# Altium project ESP32.PrjPcb
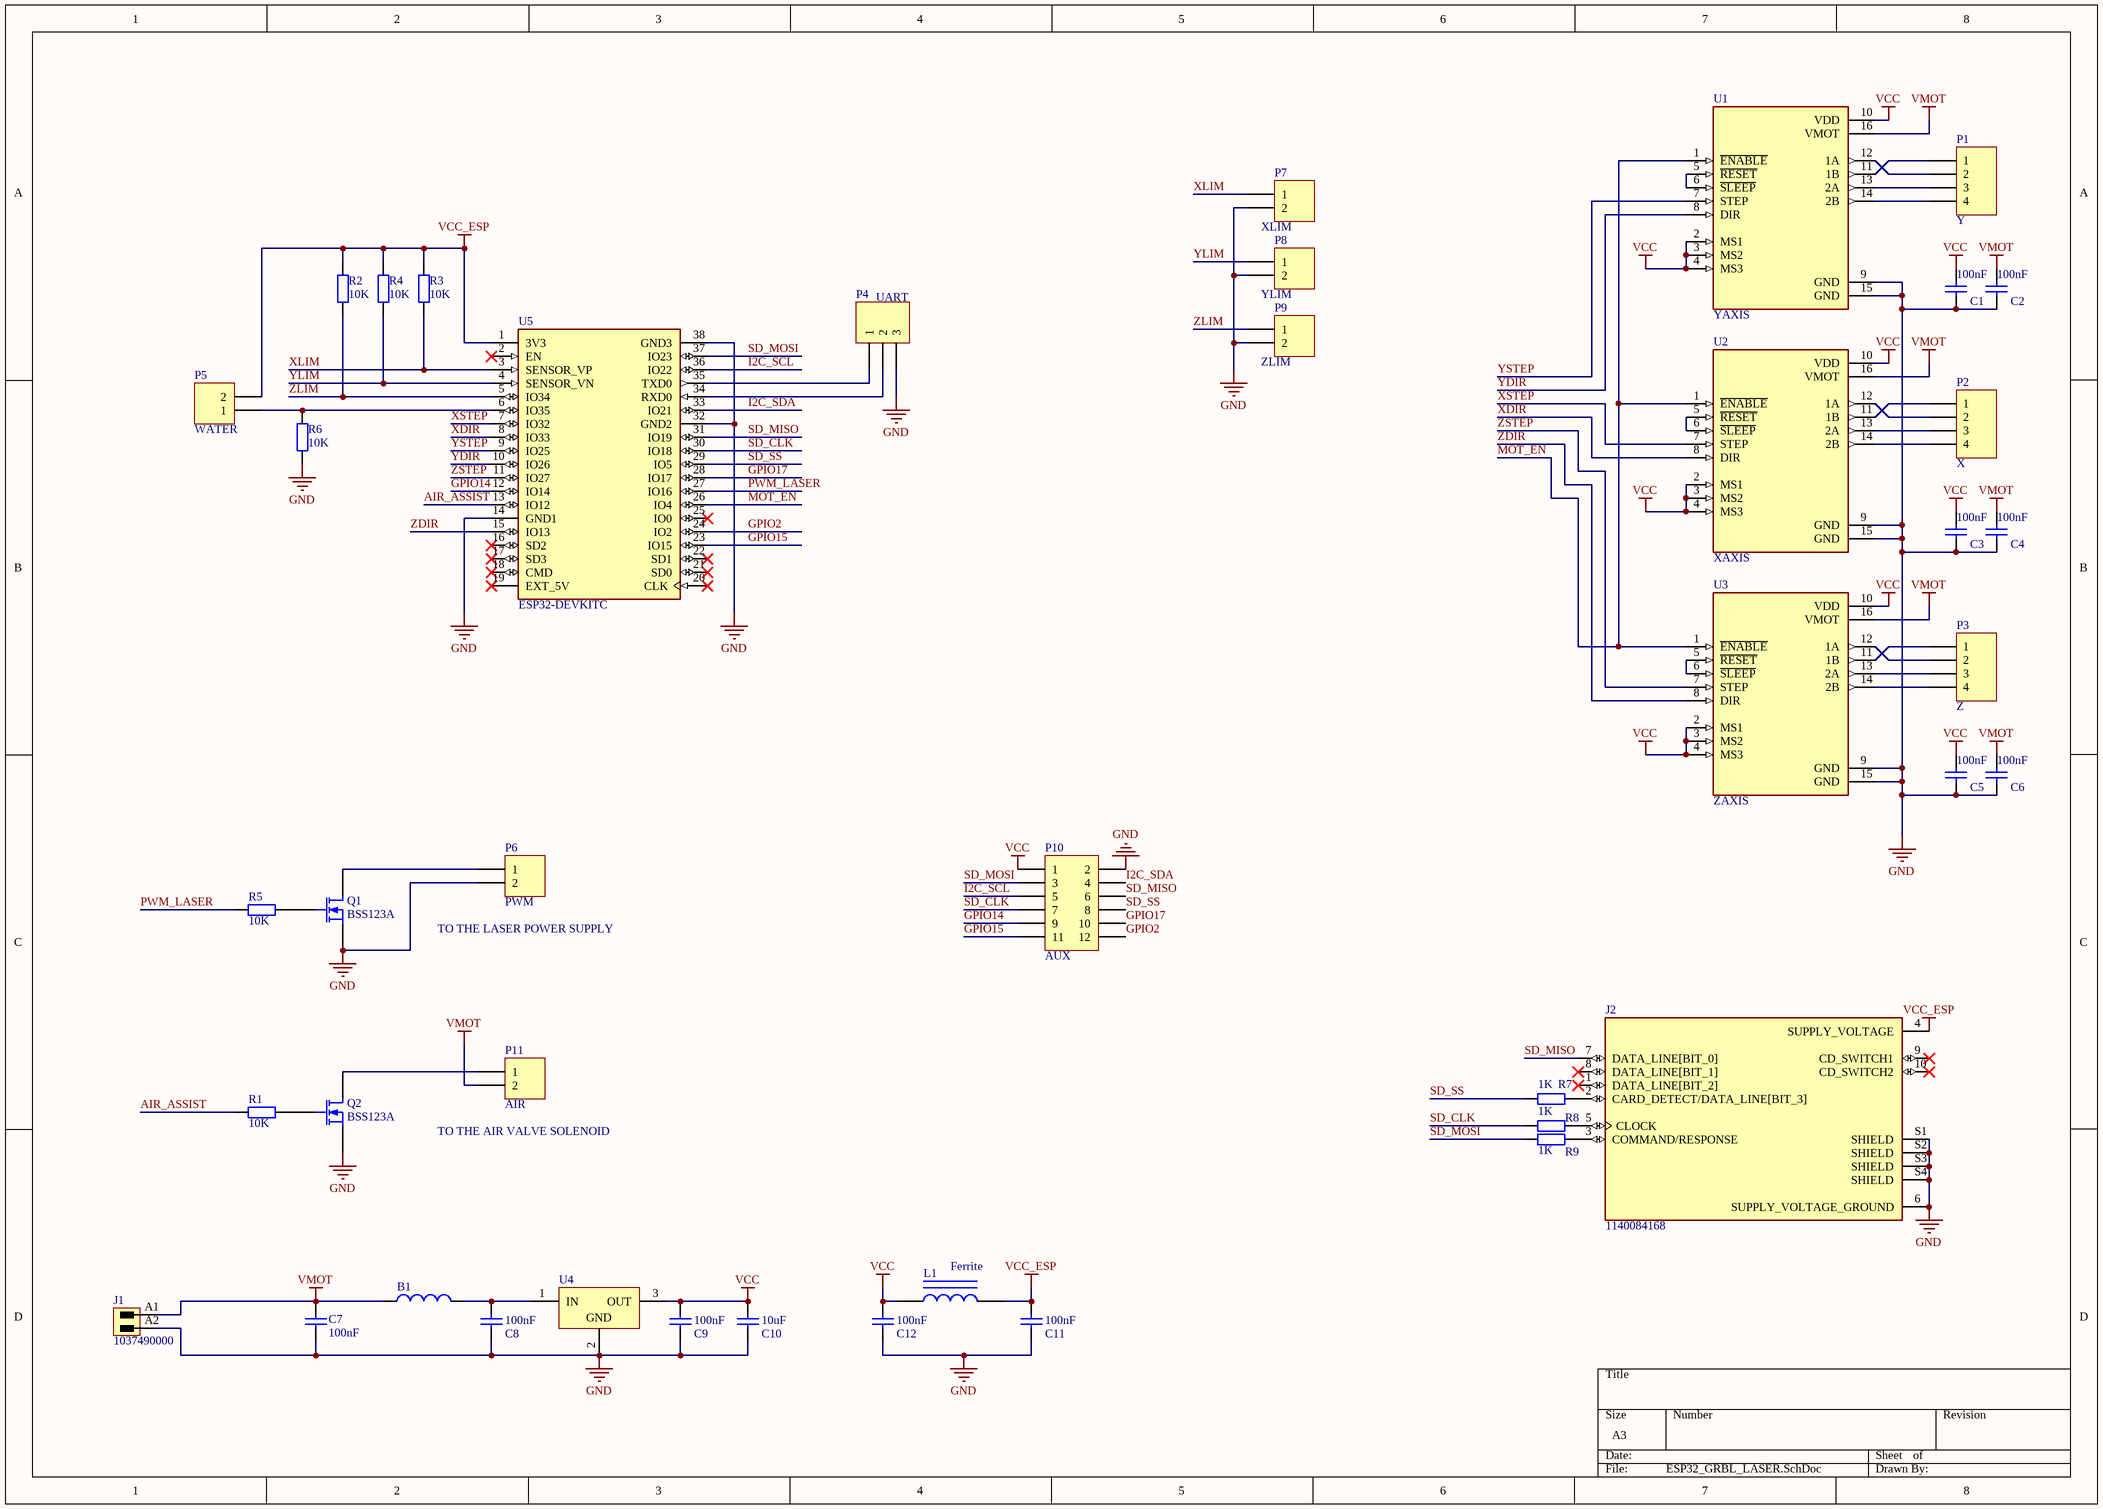
[diagram p0: ESP32_GRBL_LASER.SchDoc]
1 sheet, 43 parts. Net scope: global (net labels, ports and power ports of the same name join across sheets).
Board file: ESP32_GRBL_LASER.PcbDoc

## Sheet ESP32_GRBL_LASER.SchDoc
size A3

### Parts
B1  Ferrite  [INDC3225N]  (value not drawn)
C1  value 100nF  [0805]  (hidden comment: Cap Semi)
C2  value 100nF  [0805]  (hidden comment: Cap Semi)
C3  value 100nF  [0805]  (hidden comment: Cap Semi)
C4  value 100nF  [0805]  (hidden comment: Cap Semi)
C5  value 100nF  [0805]  (hidden comment: Cap Semi)
C6  value 100nF  [0805]  (hidden comment: Cap Semi)
C7  value 100nF  [0805]  (hidden comment: Cap Semi)
C8  value 100nF  [0805]  (hidden comment: Cap Semi)
C9  value 100nF  [0805]  (hidden comment: Cap Semi)
C10  value 10uF  [1210]  (hidden comment: Cap Semi)
C11  value 100nF  [0805]  (hidden comment: Cap Semi)
C12  value 100nF  [0805]  (hidden comment: Cap Semi)
J1  1037490000  [SC_3_81_270G_02]
J2  1140084168  [AMPHENOL_1140084168]
L1  Ferrite  [INDC2012N]
P1  Y  [HDR1X4]
P2  X  [HDR1X4]
P3  Z  [HDR1X4]
P4  UART  [HDR1X3]
P5  WATER  [HDR1X2]
P6  PWM  [HDR1X2]
P7  XLIM  [HDR1X2]
P8  YLIM  [HDR1X2]
P9  ZLIM  [HDR1X2]
P10  AUX  [HDR2X6]
P11  AIR  [HDR1X2]
Q1  BSS123A  [SOT23_M]
Q2  BSS123A  [SOT23_M]
R1  value 10K  [0805]  (hidden comment: Res2)
R2  value 10K  [0805]  (hidden comment: Res2)
R3  value 10K  [0805]  (hidden comment: Res2)
R4  value 10K  [0805]  (hidden comment: Res2)
R5  value 10K  [0805]  (hidden comment: Res2)
R6  value 10K  [0805]  (hidden comment: Res2)
R7  value 1K  [0805]  (hidden comment: Res2)
R8  value 1K  [0805]  (hidden comment: Res2)
R9  value 1K  [0805]  (hidden comment: Res2)
U1  YAXIS  [MODULE_A4988_STEPPER_MOTOR_DRIVER_CARRIER]
U2  XAXIS  [MODULE_A4988_STEPPER_MOTOR_DRIVER_CARRIER]
U3  ZAXIS  [MODULE_A4988_STEPPER_MOTOR_DRIVER_CARRIER]
U4  3V3REG  [TRS1-24xx]  (value not drawn)
U5  ESP32-DEVKITC  [MODULE_ESP32-DEVKITC]

### Nets
GND: C1.2 C2.2 C3.2 C4.2 C5.2 C6.2 C7.1 C8.2 C9.2 C10.2 C11.2 C12.2 J1.A2 J2.6(SUPPLY_VOLTAGE_GROUND) J2.S1(SHIELD) J2.S2(SHIELD) J2.S3(SHIELD) J2.S4(SHIELD) P4.3 P6.2 P7.2 P8.2 P9.2 P10.2 Q1.2(S) Q2.2(S) R6.1 U1.9(GND) U1.15(GND) U2.9(GND) U2.15(GND) U3.9(GND) U3.15(GND) U4.2(GND) U5.14(GND1) U5.32(GND2) U5.38(GND3)
VCC: C1.1 C3.1 C5.1 C9.1 C10.1 C12.1 L1.1 P10.1 U1.2(MS1) U1.3(MS2) U1.4(MS3) U1.10(VDD) U2.2(MS1) U2.3(MS2) U2.4(MS3) U2.10(VDD) U3.2(MS1) U3.3(MS2) U3.4(MS3) U3.10(VDD) U4.3(OUT)
VCC_ESP: C11.1 J2.4(SUPPLY_VOLTAGE) L1.2 P5.2 R2.1 R3.1 R4.1 U5.1(3V3)
VMOT: B1.1 C2.1 C4.1 C6.1 C7.2 J1.A1 P11.2 U1.16(VMOT) U2.16(VMOT) U3.16(VMOT)
AIR_ASSIST: R1.1 U5.13(IO12)
GPIO2: P10.12 U5.24(IO2)
GPIO14: P10.9 U5.12(IO14)
GPIO15: P10.11 U5.23(IO15)
GPIO17: P10.10 U5.28(IO17)
I2C_SCL: P10.5 U5.36(IO22)
I2C_SDA: P10.4 U5.33(IO21)
MOT_EN: U1.1(~{ENABLE}) U2.1(~{ENABLE}) U3.1(~{ENABLE}) U5.26(IO4)
PWM_LASER: R5.1 U5.27(IO16)
SD_CLK: P10.7 R8.1 U5.30(IO18)
SD_MISO: J2.7(DATA_LINE[BIT_0]) P10.6 U5.31(IO19)
SD_MOSI: P10.3 R9.1 U5.37(IO23)
SD_SS: P10.8 R7.1 U5.29(IO5)
XDIR: U2.8(DIR) U5.8(IO33)
XLIM: P7.1 R3.2 U5.3(SENSOR_VP)
XSTEP: U2.7(STEP) U5.7(IO32)
YDIR: U1.8(DIR) U5.10(IO26)
YLIM: P8.1 R4.2 U5.4(SENSOR_VN)
YSTEP: U1.7(STEP) U5.9(IO25)
ZDIR: U3.8(DIR) U5.15(IO13)
ZLIM: P9.1 R2.2 U5.5(IO34)
ZSTEP: U3.7(STEP) U5.11(IO27)
NetB1_2: B1.2 C8.1 U4.1(IN)
NetJ2_2: J2.2(CARD_DETECT/DATA_LINE[BIT_3]) R7.2
NetJ2_3: J2.3(COMMAND/RESPONSE) R9.2
NetJ2_5: J2.5(CLOCK) R8.2
NetP1_1: P1.1 U1.11(1B)
NetP1_2: P1.2 U1.12(1A)
NetP1_3: P1.3 U1.13(2A)
NetP1_4: P1.4 U1.14(2B)
NetP2_1: P2.1 U2.11(1B)
NetP2_2: P2.2 U2.12(1A)
NetP2_3: P2.3 U2.13(2A)
NetP2_4: P2.4 U2.14(2B)
NetP3_1: P3.1 U3.11(1B)
NetP3_2: P3.2 U3.12(1A)
NetP3_3: P3.3 U3.13(2A)
NetP3_4: P3.4 U3.14(2B)
NetP4_1: P4.1 U5.35(TXD0)
NetP4_2: P4.2 U5.34(RXD0)
NetP5_1: P5.1 R6.2 U5.6(IO35)
NetP6_1: P6.1 Q1.1(D)
NetP11_1: P11.1 Q2.1(D)
NetQ1_3: Q1.3(G) R5.2
NetQ2_3: Q2.3(G) R1.2
NetU1_5: U1.5(~{RESET}) U1.6(~{SLEEP})
NetU2_5: U2.5(~{RESET}) U2.6(~{SLEEP})
NetU3_5: U3.5(~{RESET}) U3.6(~{SLEEP})

Not connected (* = marked no-connect by the designer): J2 1(DATA_LINE[BIT_2])* 8(DATA_LINE[BIT_1])* 9(CD_SWITCH1)* 10(CD_SWITCH2)*; U5 2(EN)* 16(SD2)* 17(SD3)* 18(CMD)* 19(EXT_5V)* 20(CLK)* 21(SD0)* 22(SD1)* 25(IO0)*

### Notes on the sheet
- (near P6) TO THE LASER POWER SUPPLY
- (near P11) TO THE AIR VALVE SOLENOID

### Library data of the parts
B1 = Inductor: Manufacturer: Murata; Manufacturer ref: BLM31P121; Conti: 1; Revision: July-2002: Re-released for DXP Platform.; Supplier: Farnell; Supplier 2: Continental; Supplier ref: 5807293; Supplier ref 2: A2C00008628
C1-C6 C8 C9 C11 C12 = Cap Semi: Capacitor (Semiconductor SIM Model); Manufacturer: Generic Components; Voltage: 50V; Conti: 67; Revision: July-2002: Re-released for DXP Platform.; Supplier: Continental; Supplier ref: A2C00046692
C7 = Cap Semi: Capacitor (Semiconductor SIM Model); Manufacturer: Generic Components; Voltage: 50V; Conti: 30; Revision: July-2002: Re-released for DXP Platform.; Supplier: Continental; Supplier ref: A2C00046692
C10 = Cap Semi: Capacitor (Semiconductor SIM Model); Manufacturer: Generic Components; Voltage: 25V; Conti: 47; Revision: July-2002: Re-released for DXP Platform.; Supplier: Continental; Supplier ref: A2C00038896
J1 = 1037490000: OMNIMATE Signal - series BC/SC 3.81; Manufacturer: Weidmueller; Short_text_for_material: SC 3.81/02/270G 3.2SN OR BX; Side_termination_characteristic: closed side; Mounting_onto_the_PCB: Solder connection; Pitch_mm: 3.81 mm; Pitch_inch: 0.15 inch; No_of_poles: 2; Outgoing_elbow: 270°; Solder_pin_length_mm: 3.2 mm; Contact_material: Cu-Leg; Contact_surface: tinned; Insulating_material: PA GF; UL_94_flammability_rating: V-0; Rated_voltage_for_surge_voltage_class_pollution_degree_II_2: 320 V; Rated_voltage_use_group_B_UL_1059: 300 V; Rated_current_use_group_B_UL_1059: 10 A; PackageReference: SC_3_81_270G_02; Colour: Orange; Packaging: Box; Qty: 50 PCS; Revision: V1; PartNumber: 1037490000; ComponentLink1Description: Manufacturer URL; ComponentLink1URL: http://www.weidmueller.com/; ComponentLink2Description: URL Link1; ComponentLink2URL: http://catalog.weidmueller.com/catalog/Start.do?localeId=en&ObjectID=1037490000
J2 = 1140084168: 10 _8 + 2_ Position Card Connector Secure Digital - microSDâ„¢ Surface Mount, Right Angle Gold; MF: Amphenol Commercial Products; SnapEDA_Link: https://www.snapeda.com/parts/1140084168/Amphenol/view-part/4544529/?ref=snap; MP: 1140084168; Availability: Unavailable; Price: None; Value: *; Package: None
L1 = Inductor Iron: Magnetic-Core Inductor; Manufacturer: Murata; Manufacturer ref: BLM21P221S; Conti: 105; Supplier: Continental; Supplier ref: A2C00011506
P1-P3 = Header 4: Header, 4-Pin; LatestRevisionDate: 17-Jul-2002; LatestRevisionNote: Re-released for DXP Platform.; Publisher: Altium Limited
P4 = Header 3: Header, 3-Pin; LatestRevisionDate: 17-Jul-2002; LatestRevisionNote: Re-released for DXP Platform.; Publisher: Altium Limited
P5-P9 P11 = Header 2: Header, 2-Pin; LatestRevisionDate: 17-Jul-2002; LatestRevisionNote: Re-released for DXP Platform.; Publisher: Altium Limited
P10 = Header 6X2: Header, 6-Pin, Dual row; LatestRevisionDate: 17-Jul-2002; LatestRevisionNote: Re-released for DXP Platform.; Publisher: Altium Limited
Q1 Q2 = BSS123A: N-Channel Enhancement Mode Vertical DMOS FET; Published: 17-Dec-2003; DatasheetVersion: Apr-98; PackageVersion: 1996; PackageReference: SOT23; Publisher: Altium Limited; PackageDescription: SOT-23; 3 Leads; Body 3.1 x 2.5 mm, inc. leads (LxW max), Alternate Lead Configuration; ComponentLink1Description: Manufacturer Link; ComponentLink1URL: http://www.zetex.com/; ComponentLink2Description: Datasheet; ComponentLink2URL: www.zetex.com/3.0/pdf/BS123A.pdf
R1-R9 = Res2: Resistor; Manufacturer: Generic Components; Conti: 239; Revision: July-2002: Re-released for DXP Platform.
U1-U3 = A4988_STEPPER_MOTOR_DRIVER_CARRIER: Stepper Motor Driver; MP: A4988 STEPPER MOTOR DRIVER CARRIER; MF: Pololu; Availability: Unavailable; Price: None; Package: None; Value: *; SnapEDA_Link: https://www.snapeda.com/parts/A4988%20STEPPER%20MOTOR%20DRIVER%20CARRIER/Pololu/view-part/1499394/?ref=snap
U4 = TSR1-2433: Switching Regulator,18-32Vin,3.3Vout 1A; Manufacture: Traco; Manufacture Ref: TSR1-2450; LastRevisionNote: Release; LastRevisionDate: 10-Jan-2012; Supplier Ref: 666-4360; Supplier: RS; Price: 8,04
U5 = ESP32-DEVKITC: - Transceiver; 802.11 b/g/n _Wi-Fi, WiFi, WLAN_, BluetoothÂ® Smart Ready 4.x Dual Mode For Use With ESP-WROOM-32; MP: ESP32-DEVKITC-32D-F; MF: Espressif Systems; Price: None; SnapEDA_Link: https://www.snapeda.com/parts/ESP32-DEVKITC-32D-F/Espressif%20Systems/view-part/4220172/?ref=snap; Availability: Unavailable; Value: *; Package: None